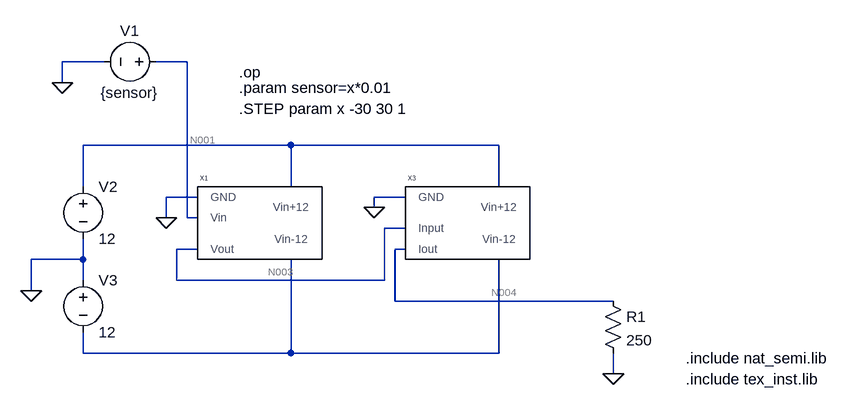
[diagram p0: schematic Diagram - Copy.asc]
Diagram - Copy.asc, the LTspice schematic file:
Version 4
SHEET 1 1044 752
WIRE -96 -48 -160 -48
WIRE 32 -48 -16 -48
WIRE -160 -16 -160 -48
WIRE 192 80 -128 80
WIRE 512 80 192 80
WIRE -128 144 -128 80
WIRE 192 144 192 80
WIRE 512 144 512 80
WIRE 48 160 0 160
WIRE 368 160 320 160
WIRE 320 176 320 160
WIRE 0 192 0 160
WIRE 32 192 32 -48
WIRE 48 192 32 192
WIRE 368 208 336 208
WIRE 48 240 16 240
WIRE 368 240 352 240
WIRE -128 256 -128 224
WIRE -128 256 -208 256
WIRE -128 288 -128 256
WIRE 16 288 16 240
WIRE 336 288 336 208
WIRE 336 288 16 288
WIRE -208 304 -208 256
WIRE 352 320 352 240
WIRE 688 320 352 320
WIRE -128 400 -128 368
WIRE 192 400 192 256
WIRE 192 400 -128 400
WIRE 512 400 512 256
WIRE 512 400 192 400
WIRE 688 432 688 400
FLAG 0 192 0
FLAG 320 176 0
FLAG -160 -16 0
FLAG -208 304 0
FLAG 688 432 0
SYMBOL Component_2 448 192 R0
SYMATTR InstName X3
SYMBOL voltage 0 -48 R90
WINDOW 0 -32 56 VBottom 2
WINDOW 3 32 56 VTop 2
SYMATTR InstName V1
SYMATTR Value {sensor}
SYMBOL Component_1 128 192 R0
SYMATTR InstName X1
SYMBOL voltage -128 128 R0
SYMATTR InstName V2
SYMATTR Value 12
SYMBOL voltage -128 272 R0
SYMATTR InstName V3
SYMATTR Value 12
SYMBOL res 672 304 R0
SYMATTR InstName R1
SYMATTR Value 250
TEXT 800 408 Left 2 !.include nat_semi.lib
TEXT 800 440 Left 2 !.include tex_inst.lib
TEXT 112 24 Left 2 !.STEP param x -30 30 1
TEXT 112 -32 Left 2 !.op
TEXT 112 -8 Left 2 !.param sensor=x*0.01

The netlist it stands for:
* Diagram - Copy.asc
XX3 0 N003 N002 N005 N004 Component_2  ; pins GND Input Vin+12 Vin-12 Iout
V1 N001 0 {sensor}
XX1 0 N003 N002 N005 N001 Component_1  ; pins GND Vout Vin+12 Vin-12 Vin
V2 N002 0 12
V3 0 N005 12
R1 N004 0 250
.include nat_semi.lib
.include tex_inst.lib
.STEP param x -30 30 1
.op
.param sensor=x*0.01
.backanno
.end

* Results of the author's LTspice run, read from the files saved beside the schematic
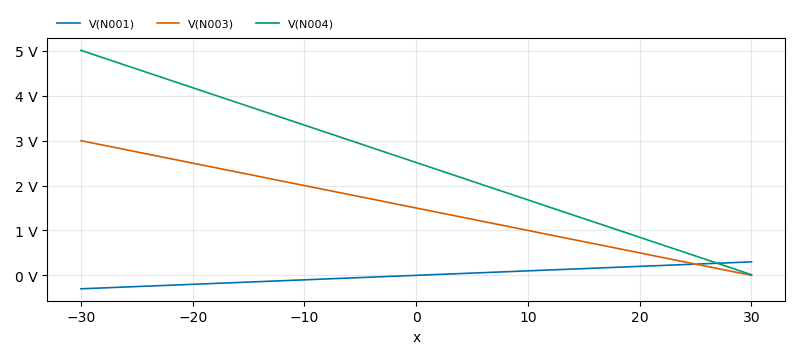
[diagram p1: Operating Point of Diagram - Copy.asc, plotted from the saved traces]
* Operating Point, 1 run:
*   V(N001): -300 mV at x=-30 , 300 mV at x=30 , min -300 mV, max 300 mV
*   V(N003): 3 V at x=-30 , -33.89 µV at x=30 , min -33.89 µV, max 3 V
*   V(N004): 5.013 V at x=-30 , 14.24 mV at x=30 , min 14.24 mV, max 5.013 V